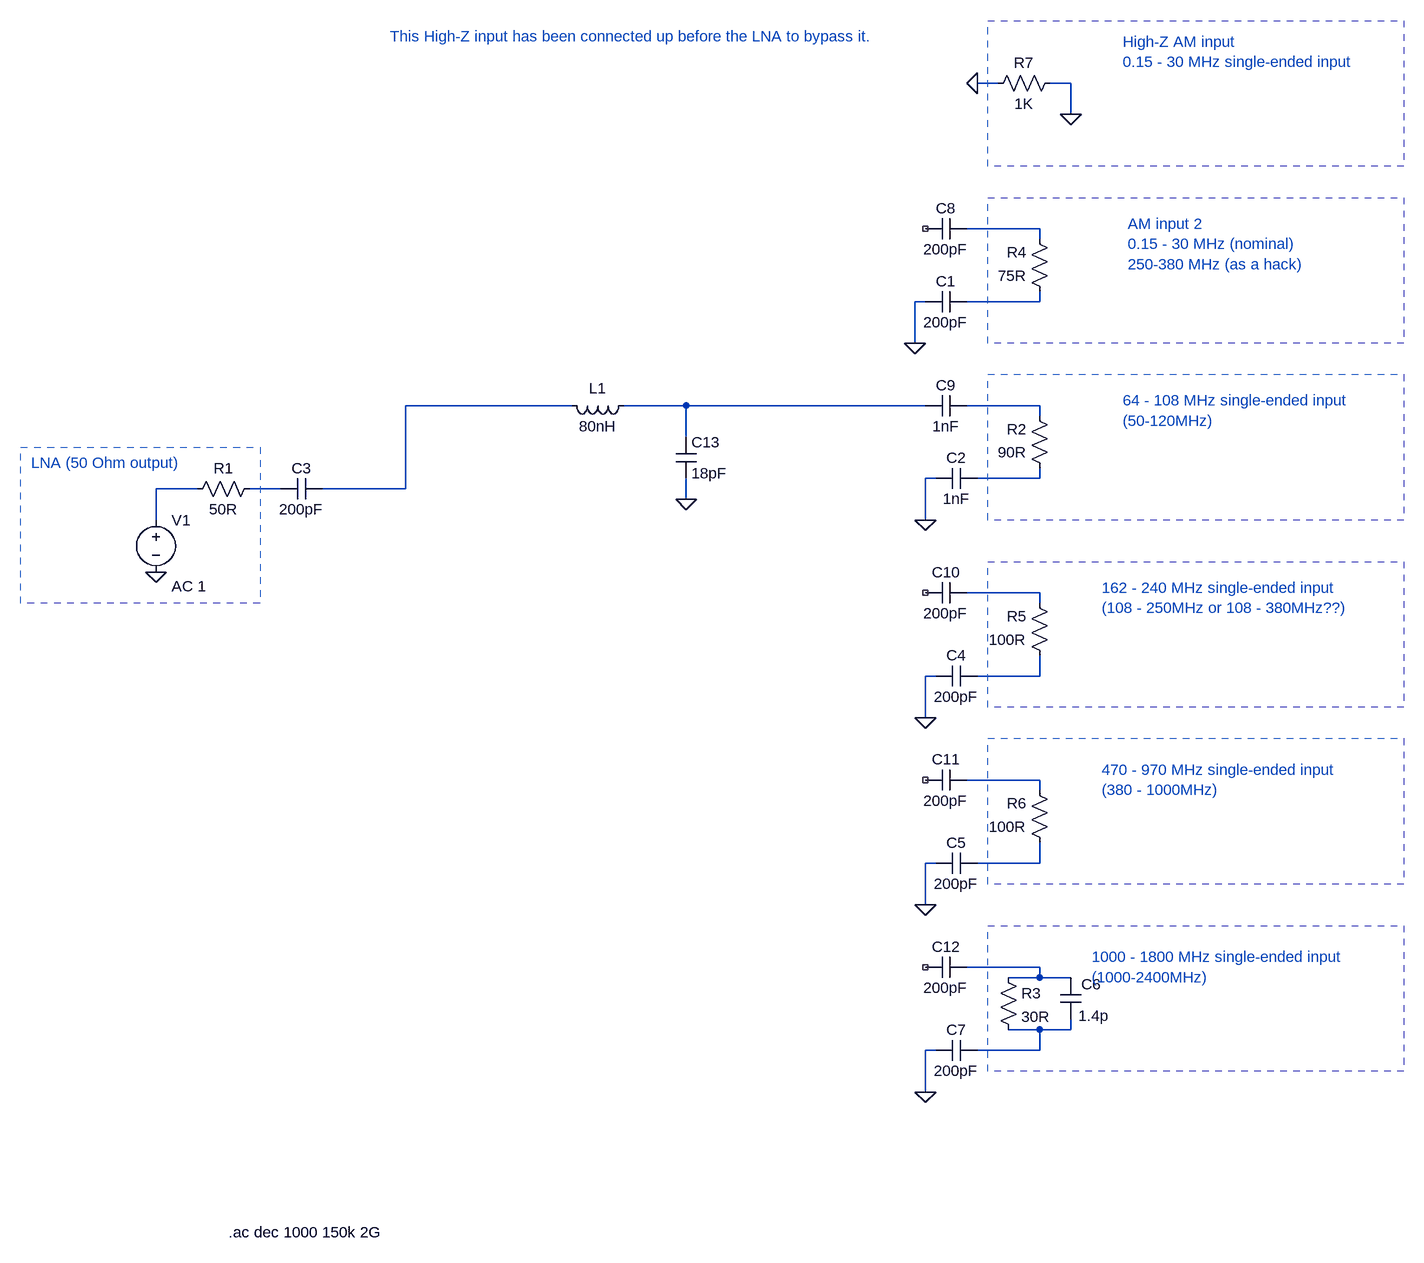
[diagram p0: schematic antenna_input_coupling_2.asc]
antenna_input_coupling_2.asc, the LTspice schematic file:
Version 4
SHEET 1 1332 1656
WIRE 464 -128 432 -128
WIRE 576 -128 544 -128
WIRE 576 -80 576 -128
WIRE 528 96 416 96
WIRE 528 112 528 96
WIRE 352 208 336 208
WIRE 528 208 528 192
WIRE 528 208 416 208
WIRE 336 272 336 208
WIRE -192 368 -448 368
WIRE -16 368 -112 368
WIRE 352 368 -16 368
WIRE 528 368 416 368
WIRE 528 384 528 368
WIRE -16 416 -16 368
WIRE 368 480 352 480
WIRE 528 480 528 464
WIRE 528 480 432 480
WIRE -768 496 -832 496
WIRE -640 496 -688 496
WIRE -448 496 -448 368
WIRE -448 496 -576 496
WIRE -16 512 -16 480
WIRE -832 544 -832 496
WIRE 352 544 352 480
WIRE 528 656 416 656
WIRE 528 672 528 656
WIRE 368 784 352 784
WIRE 528 784 528 752
WIRE 528 784 432 784
WIRE 352 848 352 784
WIRE 528 944 416 944
WIRE 528 960 528 944
WIRE 368 1072 352 1072
WIRE 528 1072 528 1040
WIRE 528 1072 432 1072
WIRE 352 1136 352 1072
WIRE 528 1232 416 1232
WIRE 528 1248 528 1232
WIRE 528 1248 480 1248
WIRE 576 1248 528 1248
WIRE 528 1328 480 1328
WIRE 576 1328 576 1312
WIRE 576 1328 528 1328
WIRE 368 1360 352 1360
WIRE 528 1360 528 1328
WIRE 528 1360 432 1360
WIRE 352 1424 352 1360
FLAG -832 624 0
FLAG 336 272 0
FLAG 576 -80 0
FLAG 432 -128 0
FLAG 352 544 0
FLAG 352 848 0
FLAG 352 1136 0
FLAG 352 1424 0
FLAG -16 512 0
SYMBOL res -672 480 R90
WINDOW 0 0 56 VBottom 2
WINDOW 3 32 56 VTop 2
SYMATTR InstName R1
SYMATTR Value 50R
SYMBOL voltage -832 528 R0
WINDOW 123 24 118 Left 2
SYMATTR Value2 AC 1
SYMATTR InstName V1
SYMATTR Value ""
SYMBOL res 544 480 R180
WINDOW 0 36 76 Left 2
WINDOW 3 36 40 Left 2
SYMATTR InstName R2
SYMATTR Value 90R
SYMBOL res 544 768 R180
WINDOW 0 36 76 Left 2
WINDOW 3 36 40 Left 2
SYMATTR InstName R5
SYMATTR Value 100R
SYMBOL res 544 1056 R180
WINDOW 0 36 76 Left 2
WINDOW 3 36 40 Left 2
SYMATTR InstName R6
SYMATTR Value 100R
SYMBOL res 464 1232 R0
SYMATTR InstName R3
SYMATTR Value 30R
SYMBOL res 544 208 R180
WINDOW 0 36 76 Left 2
WINDOW 3 36 40 Left 2
SYMATTR InstName R4
SYMATTR Value 75R
SYMBOL res 560 -144 R90
WINDOW 0 0 56 VBottom 2
WINDOW 3 32 56 VTop 2
SYMATTR InstName R7
SYMATTR Value 1K
SYMBOL cap 592 1312 R180
WINDOW 0 -31 54 Left 2
WINDOW 3 -43 5 Left 2
SYMATTR InstName C6
SYMATTR Value 1.4p
SYMBOL cap -576 480 R90
WINDOW 0 0 32 VBottom 2
WINDOW 3 32 32 VTop 2
SYMATTR InstName C3
SYMATTR Value 200pF
SYMBOL cap 416 192 R90
WINDOW 0 0 32 VBottom 2
WINDOW 3 32 32 VTop 2
SYMATTR InstName C1
SYMATTR Value 200pF
SYMBOL cap 432 464 R90
WINDOW 0 0 32 VBottom 2
WINDOW 3 32 32 VTop 2
SYMATTR InstName C2
SYMATTR Value 1nF
SYMBOL cap 432 768 R90
WINDOW 0 0 32 VBottom 2
WINDOW 3 32 32 VTop 2
SYMATTR InstName C4
SYMATTR Value 200pF
SYMBOL cap 432 1056 R90
WINDOW 0 0 32 VBottom 2
WINDOW 3 32 32 VTop 2
SYMATTR InstName C5
SYMATTR Value 200pF
SYMBOL cap 432 1344 R90
WINDOW 0 0 32 VBottom 2
WINDOW 3 32 32 VTop 2
SYMATTR InstName C7
SYMATTR Value 200pF
SYMBOL cap 416 80 R90
WINDOW 0 0 32 VBottom 2
WINDOW 3 32 32 VTop 2
SYMATTR InstName C8
SYMATTR Value 200pF
SYMBOL cap 416 352 R90
WINDOW 0 0 32 VBottom 2
WINDOW 3 32 32 VTop 2
SYMATTR InstName C9
SYMATTR Value 1nF
SYMBOL cap 416 640 R90
WINDOW 0 0 32 VBottom 2
WINDOW 3 32 32 VTop 2
SYMATTR InstName C10
SYMATTR Value 200pF
SYMBOL cap 416 928 R90
WINDOW 0 0 32 VBottom 2
WINDOW 3 32 32 VTop 2
SYMATTR InstName C11
SYMATTR Value 200pF
SYMBOL cap 416 1216 R90
WINDOW 0 0 32 VBottom 2
WINDOW 3 32 32 VTop 2
SYMATTR InstName C12
SYMATTR Value 200pF
SYMBOL ind -96 352 R90
WINDOW 0 5 56 VBottom 2
WINDOW 3 32 56 VTop 2
SYMATTR InstName L1
SYMATTR Value 80nH
SYMBOL cap -32 416 R0
SYMATTR InstName C13
SYMATTR Value 18pF
TEXT -720 1640 Left 2 !.ac dec 1000 150k 2G
TEXT -1024 456 Left 2 ;LNA (50 Ohm output)
TEXT 656 360 Left 2 ;64 - 108 MHz single-ended input\n(50-120MHz)
TEXT 624 648 Left 2 ;162 - 240 MHz single-ended input\n(108 - 250MHz or 108 - 380MHz??)
TEXT 624 928 Left 2 ;470 - 970 MHz single-ended input\n(380 - 1000MHz)
TEXT 608 1216 Left 2 ;1000 - 1800 MHz single-ended input\n(1000-2400MHz)
TEXT 664 88 Left 2 ;AM input 2\n0.15 - 30 MHz (nominal)\n250-380 MHz (as a hack)
TEXT 656 -192 Left 2 ;High-Z AM input\n0.15 - 30 MHz single-ended input
TEXT -472 -200 Left 2 ;This High-Z input has been connected up before the LNA to bypass it.
RECTANGLE Normal -1040 432 -672 672 2
RECTANGLE Normal 1088 544 448 320 2
RECTANGLE Normal 1088 832 448 608 2
RECTANGLE Normal 1088 1104 448 880 2
RECTANGLE Normal 1088 1392 448 1168 2
RECTANGLE Normal 1088 272 448 48 2
RECTANGLE Normal 1088 0 448 -224 2

The netlist it stands for:
* antenna_input_coupling_2.asc
R1 N008 N007 50R
V1 N007 0 AC 1
R2 N006 N005 90R
R5 N010 N009 100R
R6 N012 N011 100R
R3 N013 N014 30R
R4 N002 N001 75R
R7 0 0 1K
C6 N014 N013 1.4p
C3 N003 N008 200pF
C1 N002 0 200pF
C2 N006 0 1nF
C4 N010 0 200pF
C5 N012 0 200pF
C7 N014 0 200pF
C8 N001 NC_01 200pF
C9 N005 N004 1nF
C10 N009 NC_02 200pF
C11 N011 NC_03 200pF
C12 N013 NC_04 200pF
L1 N004 N003 80nH
C13 N004 0 18pF
.ac dec 1000 150k 2G
* LNA (50 Ohm output)
* 64 - 108 MHz single-ended input
* (50-120MHz)
* 162 - 240 MHz single-ended input
* (108 - 250MHz or 108 - 380MHz??)
* 470 - 970 MHz single-ended input
* (380 - 1000MHz)
* 1000 - 1800 MHz single-ended input
* (1000-2400MHz)
* AM input 2
* 0.15 - 30 MHz (nominal)
* 250-380 MHz (as a hack)
* High-Z AM input
* 0.15 - 30 MHz single-ended input
* This High-Z input has been connected up before the LNA to bypass it.
.backanno
.end